# Altium schematic sheet 9_M.2_B+M.SchDoc: M.2 M-Key Configuration
size A; Date: 12/29/25; Author: Praveen Perera; DrawnBy: Praveen Perera; Engineer: Praveen Perera; Revision: 0; SheetNumber: 9; SheetTotal: 9
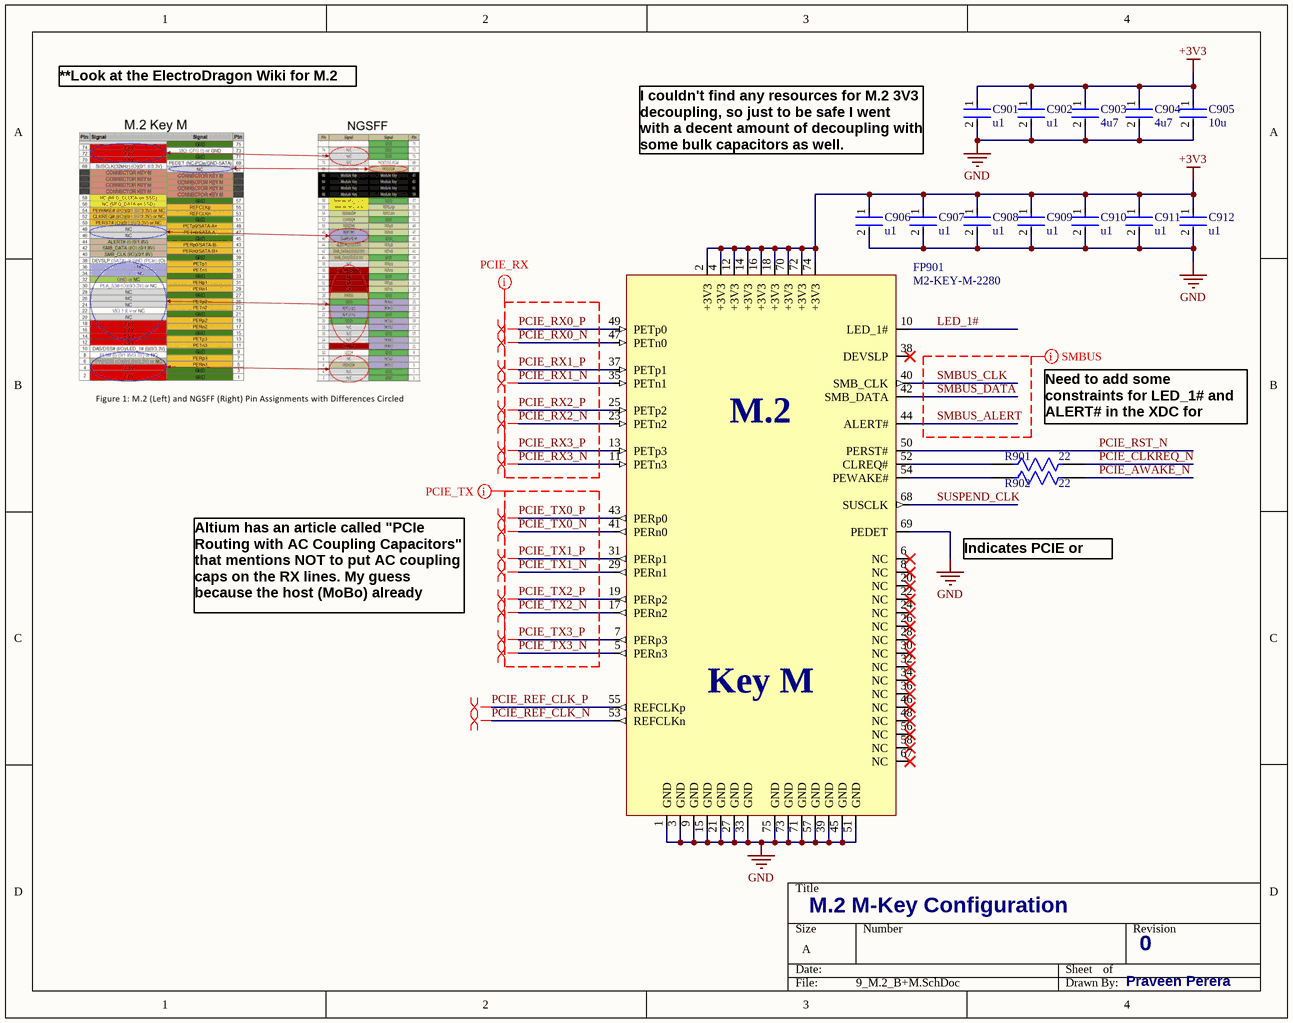
[diagram p0: 9_M.2_B+M.SchDoc]

## Parts
C901  u1  [FP-CL891-IPC_C]
C902  u1  [FP-CL891-IPC_C]
C903  4u7  [FP-CL829-IPC_C]
C904  4u7  [FP-CL829-IPC_C]
C905  10u  [FP-CL05A106MP5NUNC-MFG]
C906  u1  [FP-CL891-IPC_C]
C907  u1  [FP-CL891-IPC_C]
C908  u1  [FP-CL891-IPC_C]
C909  u1  [FP-CL891-IPC_C]
C910  u1  [FP-CL891-IPC_C]
C911  u1  [FP-CL891-IPC_C]
C912  u1  [FP-CL891-IPC_C]
FP901  M2-KEY-M-2280  [M2-KEY-M-2280]  (no BOM)
R901  22  [FP-RMCF0201-IPC_C]
R902  22  [FP-RMCF0201-IPC_C]

## Nets
+3V3: C901.1 C902.1 C903.1 C904.1 C905.1 C906.1 C907.1 C908.1 C909.1 C910.1 C911.1 C912.1 FP901.2(+3V3) FP901.4(+3V3) FP901.12(+3V3) FP901.14(+3V3) FP901.16(+3V3) FP901.18(+3V3) FP901.70(+3V3) FP901.72(+3V3) FP901.74(+3V3)
GND: C901.2 C902.2 C903.2 C904.2 C905.2 C906.2 C907.2 C908.2 C909.2 C910.2 C911.2 C912.2 FP901.1(GND) FP901.3(GND) FP901.9(GND) FP901.15(GND) FP901.21(GND) FP901.27(GND) FP901.33(GND) FP901.39(GND) FP901.45(GND) FP901.51(GND) FP901.57(GND) FP901.69(PEDET) FP901.71(GND) FP901.73(GND) FP901.75(GND)
LED_1#: FP901.10(LED_1#)
PCIE_AWAKE_N: R902.2
PCIE_CLKREQ_N: R901.2
PCIE_REF_CLK_N: FP901.53(REFCLKn)
PCIE_REF_CLK_P: FP901.55(REFCLKp)
PCIE_RST_N: FP901.50(PERST#)
PCIE_RX0_N: FP901.47(PETn0)
PCIE_RX0_P: FP901.49(PETp0)
PCIE_RX1_N: FP901.35(PETn1)
PCIE_RX1_P: FP901.37(PETp1)
PCIE_RX2_N: FP901.23(PETn2)
PCIE_RX2_P: FP901.25(PETp2)
PCIE_RX3_N: FP901.11(PETn3)
PCIE_RX3_P: FP901.13(PETp3)
PCIE_TX0_N: FP901.41(PERn0)
PCIE_TX0_P: FP901.43(PERp0)
PCIE_TX1_N: FP901.29(PERn1)
PCIE_TX1_P: FP901.31(PERp1)
PCIE_TX2_N: FP901.17(PERn2)
PCIE_TX2_P: FP901.19(PERp2)
PCIE_TX3_N: FP901.5(PERn3)
PCIE_TX3_P: FP901.7(PERp3)
SMBUS_ALERT: FP901.44(ALERT#)
SMBUS_CLK: FP901.40(SMB_CLK)
SMBUS_DATA: FP901.42(SMB_DATA)
SUSPEND_CLK: FP901.68(SUSCLK)
NetFP901_52: FP901.52(CLREQ#) R901.1
NetFP901_54: FP901.54(PEWAKE#) R902.1

Not connected (* = marked no-connect by the designer): FP901 6(NC)* 8(NC)* 20(NC)* 22(NC)* 24(NC)* 26(NC)* 28(NC)* 30(NC)* 32(NC)* 34(NC)* 36(NC)* 38(DEVSLP)* 46(NC)* 48(NC)* 56(NC)* 58(NC)* 67(NC)*

## Layout directives
differential pair: PCIE_REF_CLK_N, PCIE_REF_CLK_P, PCIE_RX0_N, PCIE_RX0_P, PCIE_RX1_N, PCIE_RX1_P, PCIE_RX2_N, PCIE_RX2_P, PCIE_RX3_N, PCIE_RX3_P, PCIE_TX0_N, PCIE_TX0_P, PCIE_TX1_N, PCIE_TX1_P, PCIE_TX2_N, PCIE_TX2_P, PCIE_TX3_N, PCIE_TX3_P
mark named SMBUS: SMBUS_ALERT, SMBUS_CLK, SMBUS_DATA
mark named PCIE_RX: PCIE_RX0_N, PCIE_RX0_P, PCIE_RX1_N, PCIE_RX1_P, PCIE_RX2_N, PCIE_RX2_P, PCIE_RX3_N, PCIE_RX3_P
mark named PCIE_TX: PCIE_TX0_N, PCIE_TX0_P, PCIE_TX1_N, PCIE_TX1_P, PCIE_TX2_N, PCIE_TX2_P, PCIE_TX3_N, PCIE_TX3_P

## Notes on the sheet
- **Look at the ElectroDragon Wiki for M.2 pins
- I couldn't find any resources for M.2 3V3 decoupling, so just to be safe I went with a decent amount of decoupling with some bulk capacitors as well.
- Need to add some constraints for LED_1# and ALERT# in the XDC for safety
- Indicates PCIE or SATA
- Altium has an article called "PCIe Routing with AC Coupling Capacitors" that mentions NOT to put AC coupling caps on the RX lines. My guess because the host (MoBo) already provides them.
- (in symbol CMP-028-000000-1) M.2; Key M

## Library data of the parts
C901 C902 C906-C912 = CMP-13271-001945-1: CL05B104KB5NNNC / Cap Ceramic 100nF 50V X7R ±10% SMD 0402 +125°C Paper T/R
C903 C904 = CMP-13271-001468-1: CL05A475MO5NUNC / Cap Ceramic 4.7uF 16V X5R ±20% SMD 0402 +85°C Paper T/R; Mount: Surface Mount; Case Code (Metric): 1005; Case/Package: 0402; Length: 0.039inch; Capacitance: 4.7uF; Voltage Rating: 16V; Max Operating Temperature: 85°C; Tolerance: 20%; Thickness: 0.022inch; Min Operating Temperature: -55°C; Case Code (Imperial): 0402; Packaging: Tape and Reel; Width: 0.02inch
C905 = CMP-13271-000002-1: CL05A106MP5NUNC / CAP CER 10UF 10V X5R 0402; Manufacturer: Samsung; Temperature Coefficient: 15%; Tolerance: 20%; Material: Ceramic; Octopart: https://octopart.com/cl05a106mp5nunc-samsung-22457395; Voltage Rating: 10V; RoHS: TRUE; Value: 10uF; Height: 0.7mm; Digikey Description: CAP CER 10UF 10V X5R 0402; Automotive: No; Package: CL05A106MP5NUNC; Device Class L1: Passive Components; Capacitance: 10uF; Temperature Range High: +85°C; ComponentLink2Description: Datasheet; Device Class L2: Capacitors; Temperature Characteristic: X5R; Manufacturer Part Number: CL05A106MP5NUNC; Temperature: -55°C to +85°C; ComponentLink2URL: http://www.samsungsem.com/kr/support/product-search/mlcc/__icsFiles/afieldfile/2019/05/10/19-CL05A106MP5NUNC.pdf; Device Class L3: Ceramic Capacitors; Category: Cap; Temperature Range Low: -55°C; Ipc Land Pattern Name: CAPC10050X50; Lead Free: Yes
FP901 = CMP-028-000000-1: M.2 Key M 22mm x 80mm; Component Type: Standard (No BOM); Design Item ID: M2-KEY-M-2280; Source: M2_2280_MKey.SchLib; Pin Count: 67
R901 R902 = CMP-26527-003623-1: RMCF0201JG22R0 / 22Ω ±5% 0.05W 0201 Thick Film Chip Resistor AEC-Q200 compliant; Max Power Dissipation: 50mW; Resistance: 22R; Temperature Coefficient: 200ppm/°C; Length: 0.024inch; Height: 0.009inch; Max Operating Temperature: 125°C; Packaging: Tape and Reel; Number of Terminations: 2; Case/Package: 0201; Resistor Type: Thick Film; Width: 0.012inch; Case Code (Metric): 0603; Min Operating Temperature: -55°C; Case Code (Imperial): 0201; Tolerance: 5%